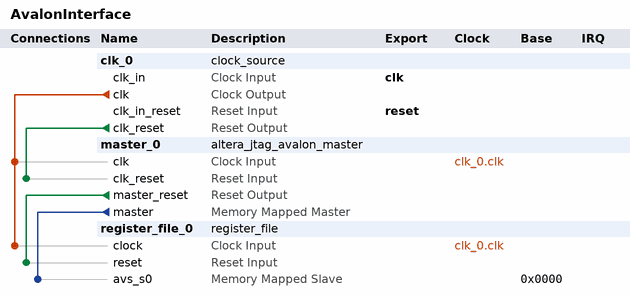
[diagram p0: system contents]
# Platform Designer (Qsys) system AvalonInterface, MAX 10 10M50DAF484C7G
# Parameters at their usual value, and those the tool derives, are not listed.
package require -exact qsys 22.1
create_system AvalonInterface
set_project_property DEVICE_FAMILY {MAX 10}
set_project_property DEVICE 10M50DAF484C7G

add_instance clk_0 clock_source 22.1
set_instance_parameter_value clk_0 clockFrequency 50000000

add_instance master_0 altera_jtag_avalon_master 22.1

add_instance register_file_0 register_file 1.0

# connections
add_connection clk_0.clk master_0.clk clock
add_connection clk_0.clk register_file_0.clock clock
add_connection clk_0.clk_reset master_0.clk_reset reset
add_connection master_0.master_reset register_file_0.reset reset
add_connection master_0.master register_file_0.avs_s0 avalon
set_connection_parameter_value master_0.master/register_file_0.avs_s0 baseAddress 0x0000

# exported interfaces
add_interface clk clock sink
set_interface_property clk EXPORT_OF clk_0.clk_in
add_interface reset reset sink
set_interface_property reset EXPORT_OF clk_0.clk_in_reset

set_interconnect_requirement {$system} qsys_mm.clockCrossingAdapter HANDSHAKE
set_interconnect_requirement {$system} qsys_mm.enableEccProtection FALSE
set_interconnect_requirement {$system} qsys_mm.insertDefaultSlave FALSE
set_interconnect_requirement {$system} qsys_mm.maxAdditionalLatency 1

save_system AvalonInterface.qsys
